# EAGLE schematic Onixium (EAGLE 9.6.2)
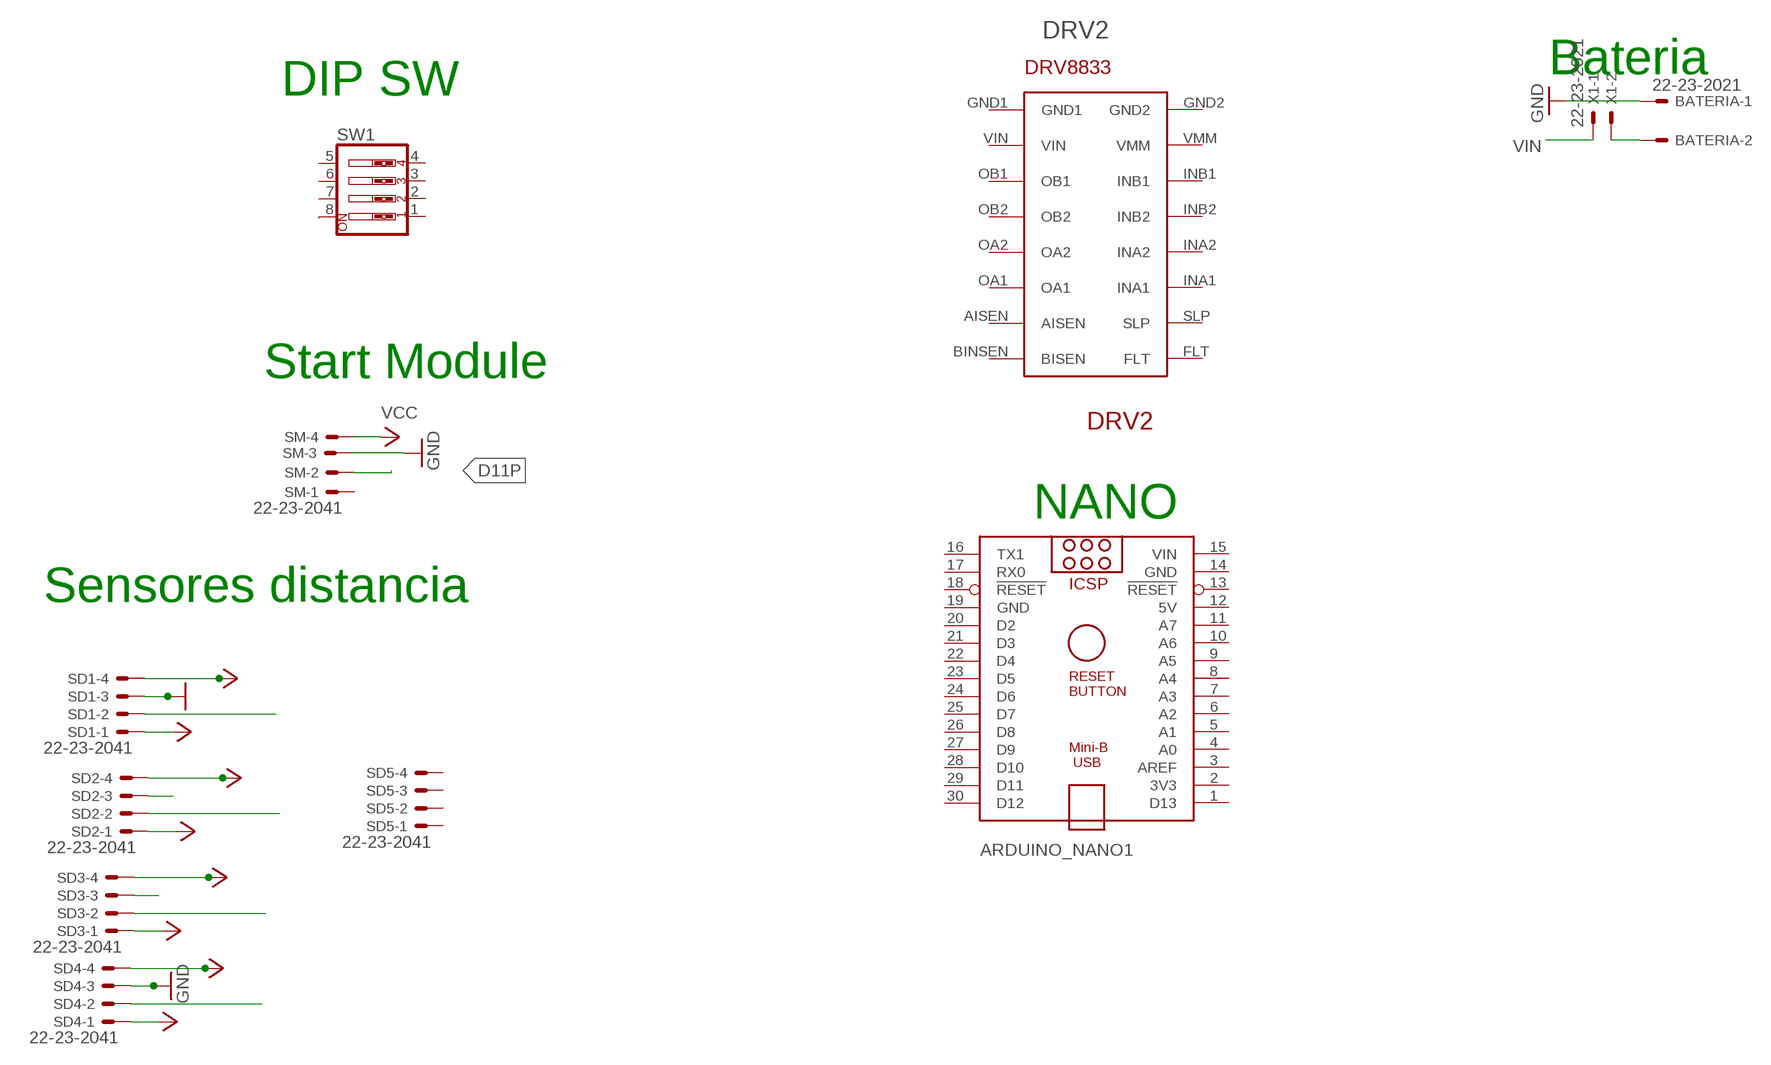
[diagram p0: schematic, sheet 1]

## Parts
ARDUINO_NANO1  ARDUINO_NANO  [ARDUINO_NANO]
BATERIA  22-23-2021  [22-23-2021]
DRV2  POLOLU-DRV8833  [POLOLU-DRV8833]
SD1  22-23-2041  [22-23-2041]
SD2  22-23-2041  [22-23-2041]
SD3  22-23-2041  [22-23-2041]
SD4  22-23-2041  [22-23-2041]
SD5  22-23-2041  [22-23-2041]
SM  22-23-2041  [22-23-2041]
SW1  SW_DIP-4  [EDG-04]
X1  22-23-2021  [22-23-2021]

## Nets
A1: SD4.2
A2: SD1.2
A3: SD2.2
A4: SD3.2
D11P: SM.2
GND: BATERIA.1 SD1.3 SD4.3 SM.3
N$3: BATERIA.2 X1.2
N$4: SD2.3
N$5: SD3.3
N$6: SW1.8
VCC: SD1.1 SD1.4 SD2.1 SD2.4 SD3.1 SD3.4 SD4.1 SD4.4 SM.4
VIN: X1.1
Unconnected: ARDUINO_NANO1.1(D13) ARDUINO_NANO1.2(3V3) ARDUINO_NANO1.3(AREF) ARDUINO_NANO1.4(A0) ARDUINO_NANO1.5(A1) ARDUINO_NANO1.6(A2) ARDUINO_NANO1.7(A3) ARDUINO_NANO1.8(A4) ARDUINO_NANO1.9(A5) ARDUINO_NANO1.10(A6) ARDUINO_NANO1.11(A7) ARDUINO_NANO1.13(!RESET) ARDUINO_NANO1.16(TX1) ARDUINO_NANO1.17(RX0) ARDUINO_NANO1.18(!RESET) ARDUINO_NANO1.20(D2) ARDUINO_NANO1.21(D3) ARDUINO_NANO1.22(D4) ARDUINO_NANO1.23(D5) ARDUINO_NANO1.24(D6) ARDUINO_NANO1.25(D7) ARDUINO_NANO1.26(D8) ARDUINO_NANO1.27(D9) ARDUINO_NANO1.28(D10) ARDUINO_NANO1.29(D11) ARDUINO_NANO1.30(D12) DRV2.AISEN DRV2.BINSEN(BISEN) DRV2.FLT DRV2.GND1 DRV2.GND2 DRV2.INA1 DRV2.INA2 DRV2.INB1 DRV2.INB2 DRV2.OA1 DRV2.OA2 DRV2.OB1 DRV2.OB2 DRV2.SLP DRV2.VIN DRV2.VMM SD5.1 SD5.2 SD5.3 SD5.4 SM.1 SW1.1 SW1.2 SW1.3 SW1.4 SW1.5 SW1.6 SW1.7

## Notes on the sheet
- Bateria
- DIP SW
- Start Module
- NANO
- Sensores distancia

## Power pins joined to a net without a drawn wire
5V: ARDUINO_NANO1.12(5V)
GND: ARDUINO_NANO1.14(GND) ARDUINO_NANO1.19(GND)
VIN: ARDUINO_NANO1.15(VIN)

## Library data of the parts
ARDUINO_NANO1 = ArduinoNanoV30:ARDUINO_NANO: Arduino Nano V3.0 Overview: The Arduino Nano is a small, complete, and breadboard-friendly board based on the ATmega328 (Arduino Nano 3.x) or ATmega168 (Arduino Nano 2.x). It has more or less the same functionality of the Arduino Duemilanove, but in a different package. It lacks only a DC power jack, and works with a Mini-B USB cable instead of a standard one. The Nano was designed and is being produced by Gravitech. Specifications: Microcontroller Atmel ATmega168 or ATmega328 Operating Voltage (logic level) 5 V Input Voltage (recommended) 7-12 V Input Voltage (limits) 6-20 V Digital I/O Pins 14 (of which 6 provide PWM output) Analog Input Pins 8 DC Current per I/O Pin 40 mA Flash Memory 16 KB (ATmega168) or 32 KB (ATmega328) of which 2 KB used by bootloader SRAM 1 KB (ATmega168) or 2 KB (ATmega328) EEPROM 512 bytes (ATmega168) or 1 KB (ATmega328) Clock Speed 16 MHz Dimensions 0.73" x 1.70" Length 45 mm Width 18 mm Weigth 5 g Power: The Arduino Nano can be powered via the Mini-B USB connection, 6-20V unregulated external power supply (pin 30), or 5V regulated external power supply (pin 27). The power source is automatically selected to the highest voltage source. Memory: The ATmega168 has 16 KB of flash memory for storing code (of which 2 KB is used for the bootloader); the ATmega328 has 32 KB, (also with 2 KB used for the bootloader). The ATmega168 has 1 KB of SRAM and 512 bytes of EEPROM (which can be read and written with the EEPROM library); the ATmega328 has 2 KB of SRAM and 1 KB of EEPROM. Input and Output: Each of the 14 digital pins on the Nano can be used as an input or output, using pinMode(), digitalWrite(), and digitalRead() functions. They operate at 5 volts. Each pin can provide or receive a maximum of 40 mA and has an internal pull-up resistor (disconnected by default) of 20-50 kOhms. In addition, some pins have specialized functions. Visit Arduino - ArduinoBoardNano <https://www.arduino.cc/en/Main/ArduinoBoardNano>
BATERIA X1 = con-molex:22-23-2021: .100" (2.54mm) Center Header - 2 Pin; MF: MOLEX; MPN: 22-23-2021; OC_FARNELL: 1462926; OC_NEWARK: 25C3832
DRV2 = Pololu_Driver_DRV8833:POLOLU-DRV8833: Created by: Deltarios DRV8833 pololu dual drive controller, PCB-ready device
SD1-SD5 SM = con-molex:22-23-2041: .100" (2.54mm) Center Header - 4 Pin; MF: MOLEX; MPN: 22-23-2041; OC_FARNELL: 1462920; OC_NEWARK: 38C0355
SW1 = special:SW_DIP-4: DIP SWITCH